# Altium project MINI-STM32.PRJPCB
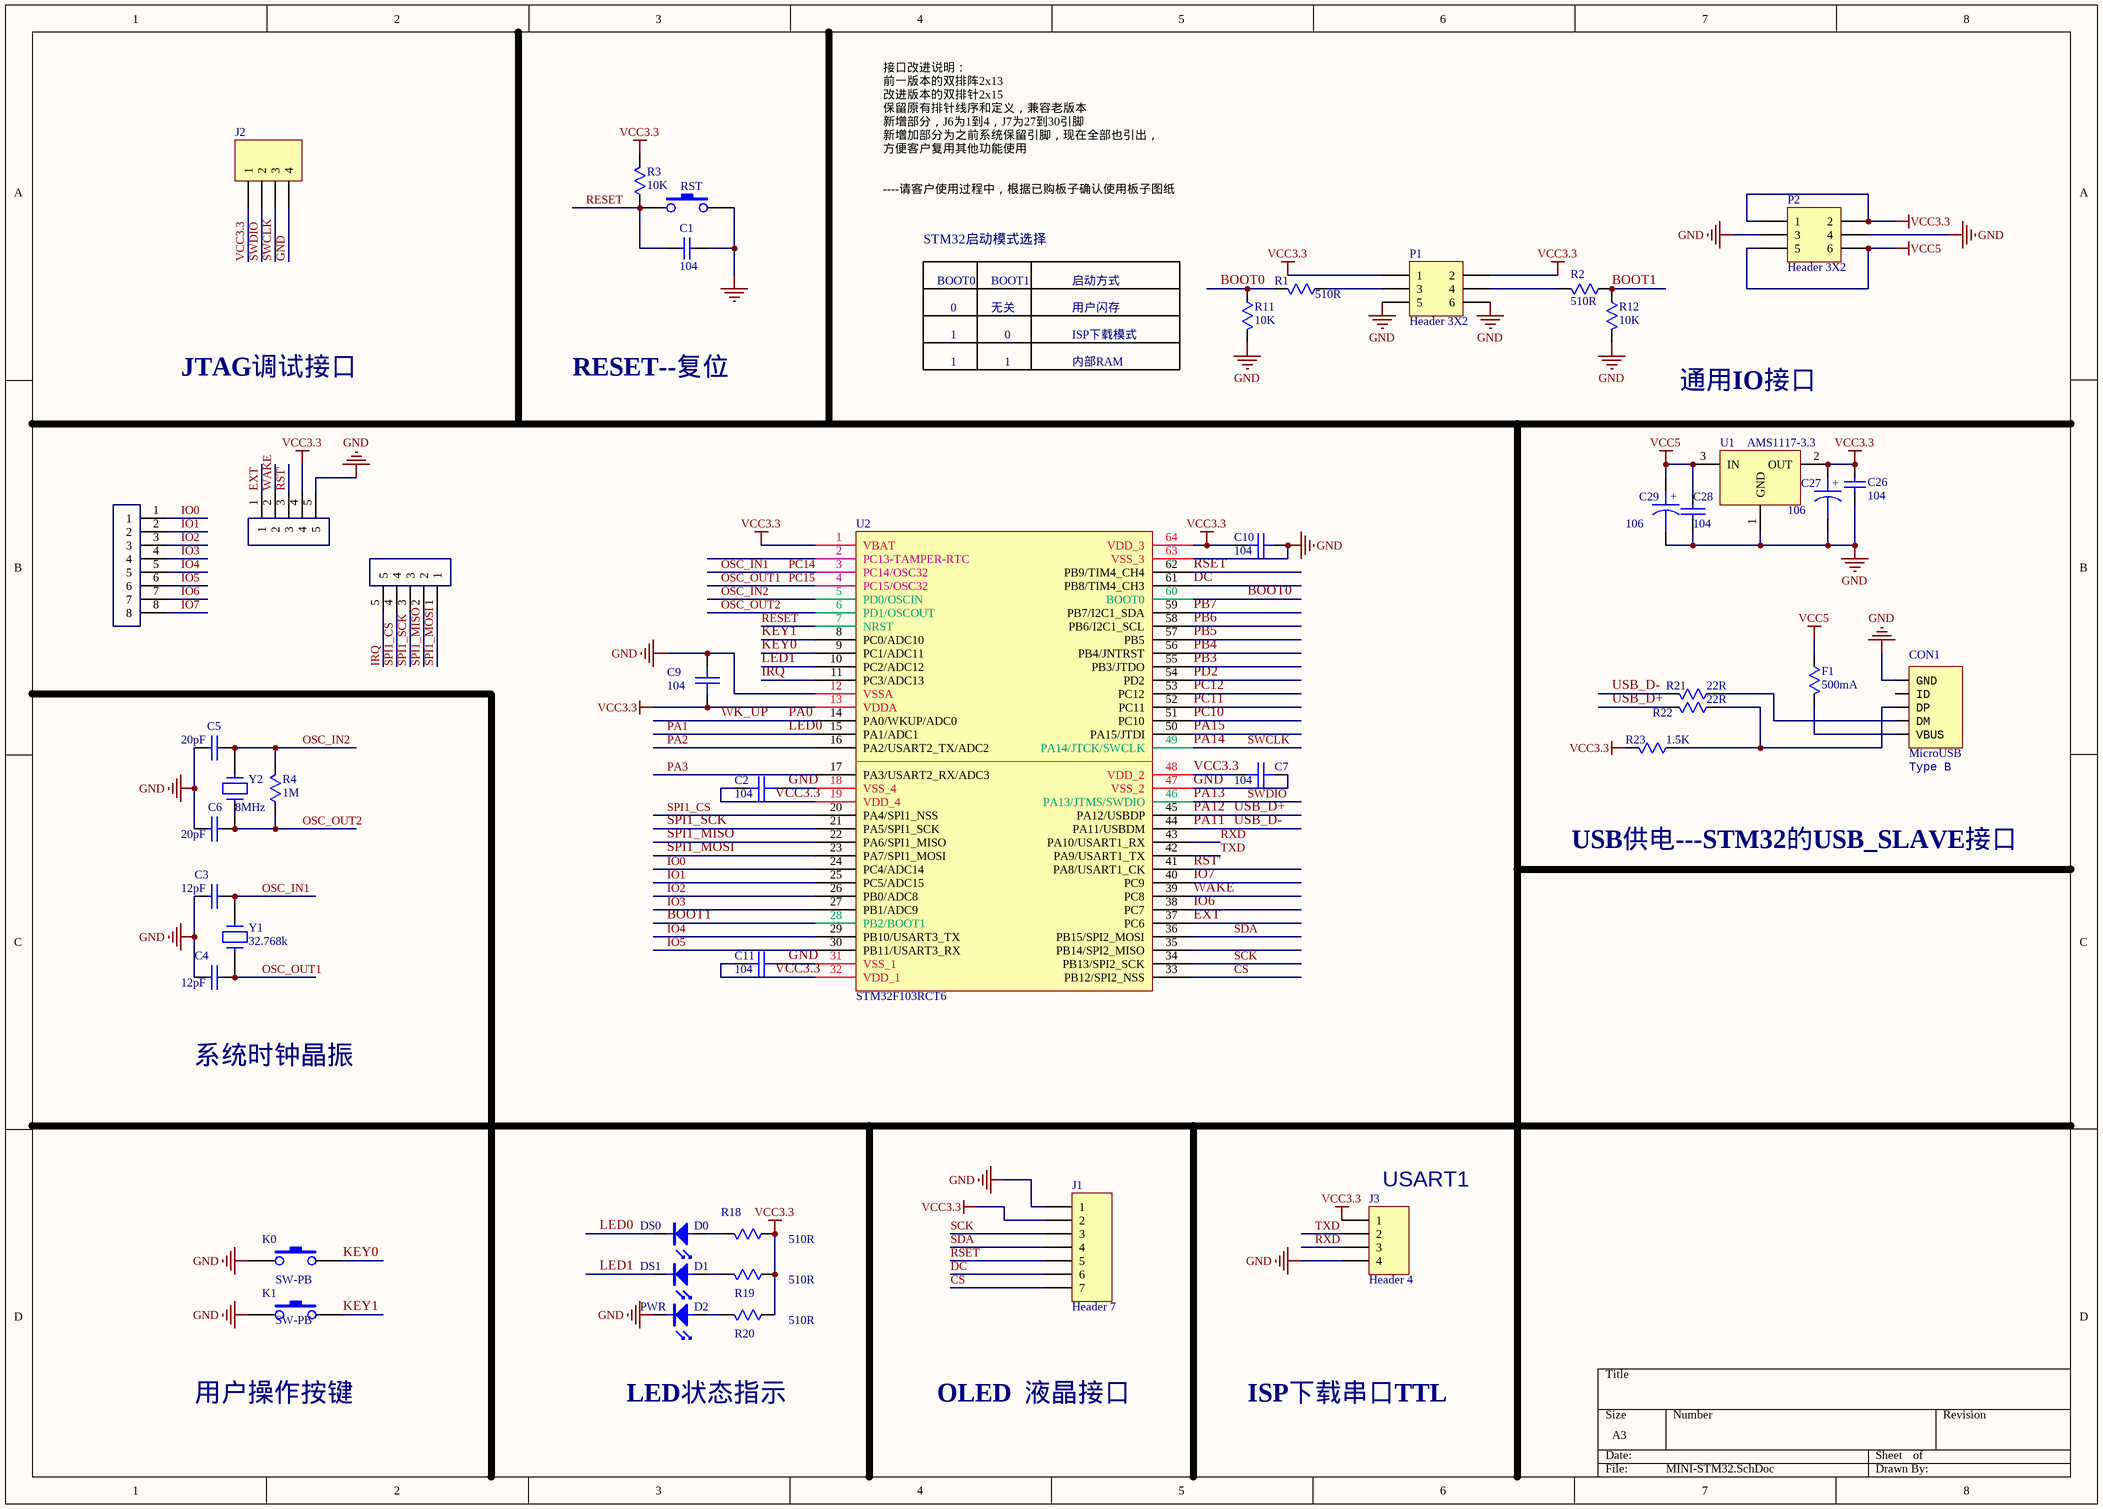
[diagram p0: MINI-STM32.SchDoc]
1 sheet, 46 parts. Net scope: global (net labels, ports and power ports of the same name join across sheets).
Board files: MINI-STM32.PcbDoc, UWB-NODEV1.PcbDoc

## Sheet MINI-STM32.SchDoc
size A3

### Parts
C1  104  [0603C]
C2  104  [0603J]
C3  12pF  [0603J]
C4  12pF  [0603J]
C5  20pF  [0603J]
C6  20pF  [0603J]
C7  104  [0603J]
C9  104  [0603J]
C10  104  [0603J]
C11  104  [0603J]
C26  104  [0603J]
C27  106  [RC0805]
C28  104  [0603J]
C29  106  [RC0805]
CON1  MicroUSB  value Type B  [USB_Micro-AB]
D0  DS0  [LED0805]
D1  DS1  [LED0805]
D2  PWR  [LED0805]
F1  500mA  [RC0805]
J1  Header 7  [HDR1X7]
J2  Header 4  [HDR1X4]  (value not drawn)
J3  Header 4  [HDR1X4]
J090  J1X8  [HDR1X8]  (value not drawn)
J091  J1X5  [HDR1X5]  (value not drawn)
J092  J1X5  [HDR1X5]  (value not drawn)
K0  SW-PB  [SW-SPST]
K1  SW-PB  [SW-SPST]
P1  Header 3X2  [HDR2X3]
P2  Header 3X2  [HDR2X3]
R1  510R  [0603J]
R2  510R  [0603J]
R3  10K  [0603J]
R4  1M  [0603J]
R11  10K  [0603J]
R12  10K  [0603J]
R18  510R  [0603J]
R19  510R  [0603J]
R20  510R  [0603J]
R21  22R  [0603J]
R22  22R  [0603]
R23  1.5K  [0603J]
RST  (no value)  [SW-SPST]
U1  AMS1117-3.3  [SOT223]
U2  STM32F103RCT6  [LQFP64]
Y1  32.768k  [32.768k]
Y2  8MHz  [smt-xtal]

### Nets
GND: C1.1 C2.2 C3.1 C4.1 C5.1 C6.1 C7.2 C9.1 C10.2 C11.2 C26.2 C27.2 C28.2 C29.2 CON1.5(GND) D2.2 J1.1 J2.4 J3.4 J091.5 K0.1 K1.1 P1.5 P1.6 P2.3 P2.4 R11.2 R12.2 RST.2 U1.1(GND) U2.12(VSSA) U2.18(VSS_4) U2.31(VSS_1) U2.47(VSS_2) U2.63(VSS_3)
VCC3.3: C2.1 C7.1 C9.2 C10.1 C11.1 C26.1 C27.1 J1.2 J2.1 J3.1 J091.4 P1.1 P1.2 P2.1 P2.2 R3.2 R18.1 R19.1 R20.1 R23.2 U1.2(OUT) U2.1(VBAT) U2.13(VDDA) U2.19(VDD_4) U2.32(VDD_1) U2.48(VDD_2) U2.64(VDD_3)
VCC5: C28.1 C29.1 F1.1 P2.5 P2.6 U1.3(IN)
BOOT0: R1.2 R11.1 U2.60(BOOT0)
BOOT1: R2.1 R12.1 U2.28(PB2/BOOT1)
CS: J1.7 U2.33(PB12/SPI2_NSS)
DC: J1.6 U2.61(PB8/TIM4_CH3)
EXT: J091.1 U2.37(PC6)
IO0: J090.1 U2.24(PC4/ADC14)
IO1: J090.2 U2.25(PC5/ADC15)
IO2: J090.3 U2.26(PB0/ADC8)
IO3: J090.4 U2.27(PB1/ADC9)
IO4: J090.5 U2.29(PB10/USART3_TX)
IO5: J090.6 U2.30(PB11/USART3_RX)
IO6: J090.7 U2.38(PC7)
IO7: J090.8 U2.40(PC9)
IRQ: J092.5 U2.11(PC3/ADC13)
KEY0: K0.2 U2.9(PC1/ADC11)
KEY1: K1.2 U2.8(PC0/ADC10)
LED0: D0.2 U2.15(PA1/ADC1)  [also labelled PA1]
LED1: D1.2 U2.10(PC2/ADC12)
OSC_IN1: C3.2 U2.3(PC14/OSC32) Y1.2  [also labelled PC14]
OSC_IN2: C5.2 R4.2 U2.5(PD0/OSCIN) Y2.1
OSC_OUT1: C4.2 U2.4(PC15/OSC32) Y1.1  [also labelled PC15]
OSC_OUT2: C6.2 R4.1 U2.6(PD1/OSCOUT) Y2.2
PA0: U2.14(PA0/WKUP/ADC0)  [also labelled WK_UP]
PA2: U2.16(PA2/USART2_TX/ADC2)
PA3: U2.17(PA3/USART2_RX/ADC3)
PA11: R21.2 U2.44(PA11/USBDM)  [also labelled USB_D-]
PA12: R22.2 U2.45(PA12/USBDP)  [also labelled USB_D+]
PA13: J2.2 U2.46(PA13/JTMS/SWDIO)  [also labelled SWDIO]
PA14: J2.3 U2.49(PA14/JTCK/SWCLK)  [also labelled SWCLK]
PA15: U2.50(PA15/JTDI)
PB3: U2.55(PB3/JTDO)
PB4: U2.56(PB4/JNTRST)
PB5: U2.57(PB5)
PB6: U2.58(PB6/I2C1_SCL)
PB7: U2.59(PB7/I2C1_SDA)
PC10: U2.51(PC10)
PC11: U2.52(PC11)
PC12: U2.53(PC12)
PD2: U2.54(PD2)
RESET: C1.2 R3.1 RST.1 U2.7(NRST)
RSET: J1.5 U2.62(PB9/TIM4_CH4)
RST': J091.3 U2.41(PA8/USART1_CK)
RXD: J3.3 U2.43(PA10/USART1_RX)
SCK: J1.3 U2.34(PB13/SPI2_SCK)
SDA: J1.4 U2.36(PB15/SPI2_MOSI)
SPI1_CS: J092.4 U2.20(PA4/SPI1_NSS)
SPI1_MISO: J092.2 U2.22(PA6/SPI1_MISO)
SPI1_MOSI: J092.1 U2.23(PA7/SPI1_MOSI)
SPI1_SCK: J092.3 U2.21(PA5/SPI1_SCK)
TXD: J3.2 U2.42(PA9/USART1_TX)
WAKE: J091.2 U2.39(PC8)
NetCON1_1: CON1.1(VBUS) F1.2
NetCON1_2: CON1.2(DM) R21.1
NetCON1_3: CON1.3(DP) R22.1 R23.1
NetD0_1: D0.1 R18.2
NetD1_1: D1.1 R19.2
NetD2_1: D2.1 R20.2
NetP1_3: P1.3 R1.1
NetP1_4: P1.4 R2.2

Not connected (* = marked no-connect by the designer): CON1 0(SH) 4(ID); U2 2(PC13-TAMPER-RTC) 35(PB14/SPI2_MISO)

### Notes on the sheet
- 接口改进说明：
  前一版本的双排阵2x13
  改进版本的双排针2x15
  保留原有排针线序和定义，兼容老版本
  新增部分，J6为1到4，J7为27到30引脚
  新增加部分为之前系统保留引脚，现在全部也引出，
  方便客户复用其他功能使用
  ----请客户使用过程中，根据已购板子确认使用板子图纸
- STM32启动模式选择
- BOOT0
- 0
- BOOT1
- 无关
- 启动方式
- 用户闪存
- JTAG调试接口
- RESET--复位
- 1
- ISP下载模式
- 内部RAM
- 通用IO接口
- USB供电---STM32的USB_SLAVE接口
- 系统时钟晶振
- (near J3) USART1
- 用户操作按键
- LED状态指示
- OLED  液晶接口
- ISP下载串口TTL
- (in symbol CAPACITOR POL) +

### Library data of the parts
C1 = CAP: GRM39 X7R102K50PT; Value: 100pF; Published: 8-Jun-2000; Revision: July-2002: Re-released for DXP Platform.; Publisher: Altium Limited; REF: GRM39 X7R102K50PT
C2 C7 C9-C11 = CAP
C3 C4 = CAP: CAP CHIP 20P 50V(+-5% C0G 0603); Value: 20pF
C5 C6 = CAP: CAP CHIP 20P 50V(+-5% C0G 0603); Value: 20pF
C26 = Cap: Capacitor; Published: 8-Jun-2000; LatestRevisionDate: 17-Jul-2002; LatestRevisionNote: Re-released for DXP Platform.; PackageReference: RAD-0.3; Publisher: Altium Limited
C27 C29 = CAPACITOR POL: Capacitor
C28 = CAP: Capacitor
CON1 = USB_Micro: USB; Type: *; Link: *
D0-D2 = LED
F1 R1-R4 R11 R12 R18-R23 = RES
J1 = Header 7: Header, 7-Pin; LatestRevisionDate: 17-Jul-2002; LatestRevisionNote: Re-released for DXP Platform.; Publisher: Altium Limited
J2 J3 = Header 4: Header, 4-Pin; LatestRevisionDate: 17-Jul-2002; LatestRevisionNote: Re-released for DXP Platform.; Publisher: Altium Limited
P1 P2 = Header 3X2: Header, 3-Pin, Dual row; LatestRevisionDate: 17-Jul-2002; LatestRevisionNote: Re-released for DXP Platform.; Publisher: Altium Limited
RST = SW-PB
U1 = LT1085CM-3.3
U2 = STM32F103RBT6
Y1 Y2 = CRYSTAL: Crystal 8MHz PLUG; Value: 8MHz